# EAGLE design SGP30_breakout (EAGLE 8.3.2)
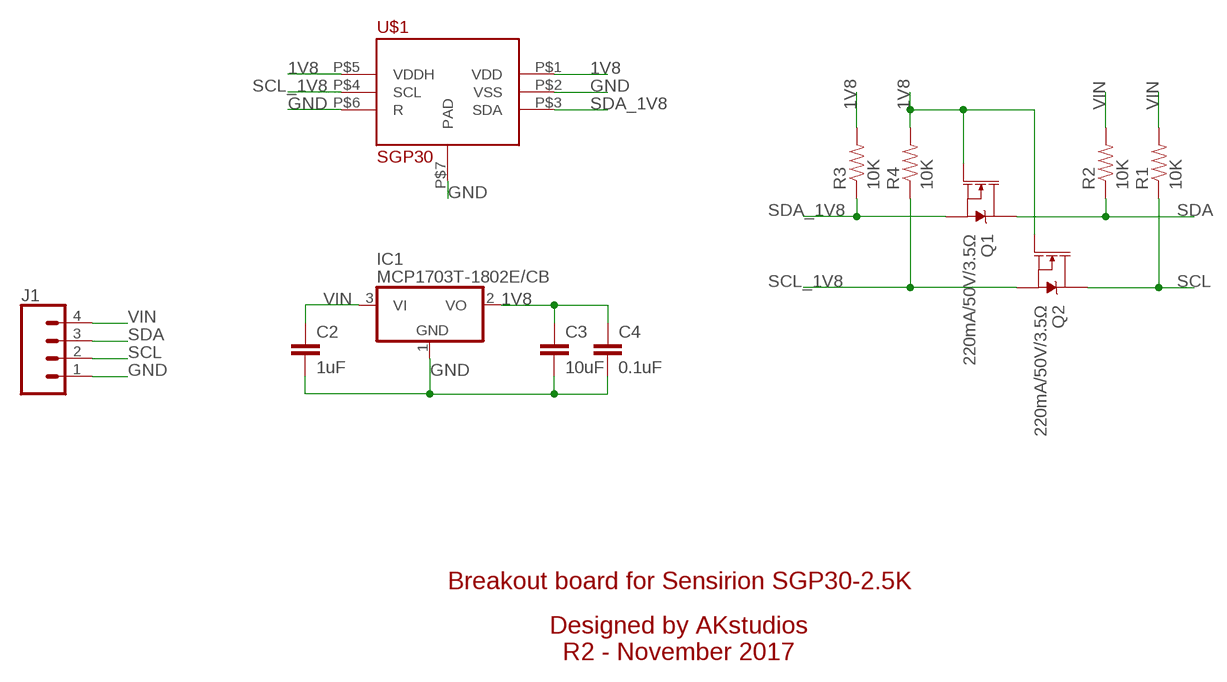
[diagram p0: schematic, sheet 1]

## Parts
C2  1uF  CAP0805  [0805]
C3  10uF  CAP0805  [0805]
C4  0.1uF  CAP0805  [0805]
IC1  MCP1703T-1802E/CB  MCP1703CB  [SOT23]
J1  CONN_04  [1X04]
Q1  220mA/50V/3.5Ω  MOSFET-NCH-BSS138  [SOT23-3]
Q2  220mA/50V/3.5Ω  MOSFET-NCH-BSS138  [SOT23-3]
R1  10K  RESISTOR0805-RES  [0805]
R2  10K  RESISTOR0805-RES  [0805]
R3  10K  RESISTOR0805-RES  [0805]
R4  10K  RESISTOR0805-RES  [0805]
U$1  SGP30  [DFN]

## Nets
1V8: C3.1 C4.1 IC1.2(VO) Q1.1(G) Q2.1(G) R3.2 R4.2 U$1.P$1(VDD) U$1.P$5(VDDH)
GND: C2.2 C3.2 C4.2 IC1.1(GND) J1.1 U$1.P$2(VSS) U$1.P$6(R) U$1.P$7(PAD)
SCL: J1.2 Q2.3(D) R1.1
SCL_1V8: Q2.2(S) R4.1 U$1.P$4(SCL)
SDA: J1.3 Q1.3(D) R2.1
SDA_1V8: Q1.2(S) R3.1 U$1.P$3(SDA)
VIN: C2.1 IC1.3(VI) J1.4 R1.2 R2.2

## Notes on the sheet
- Breakout board for Sensirion SGP30-2.5K
- Designed by AKstudios
  R2 - November 2017

## Library data of the parts
C2-C4 = SparkFun-Passives:CAP: Capacitor Standard 0603 ceramic capacitor, and 0.1" leaded capacitor.
IC1 = linear:MCP1703: 250 mA, 16V, Low Quiescent Current LDO Regulator Source: http://ww1.microchip.com/downloads/en/DeviceDoc/22049b.pdf
J1 = SparkFun-Connectors:CONN_04: Multi connection point. Often used as Generic Header-pin footprint for 0.1 inch spaced/style header connections On any of the 0.1 inch spaced packages, you can populate with these: Break Away Headers - Straight <https://www.sparkfun.com/products/116> (PRT-00116) Break Away Male Headers - Right Angle <https://www.sparkfun.com/products/553> (PRT-00553) Female Headers <https://www.sparkfun.com/products/115> (PRT-00115) Break Away Headers - Machine Pin <https://www.sparkfun.com/products/117> (PRT-00117) Break Away Female Headers - Swiss Machine Pin <https://www.sparkfun.com/products/743> (PRT-00743) For SCREWTERMINALS and SPRING TERMINALS visit here: Screw Terimnals on SparkFun.com <https://www.sparkfun.com/search/results?term=Screw+Terminals> (5mm/3.5mm/2.54mm spacing) This device is also useful as a general connection point to wire up your design to another part of your project. Our various solder wires solder well into these plated through hole pads. Hook-Up Wire - Assortment (Stranded, 22 AWG) <https://www.sparkfun.com/products/11375> (PRT-11375) Hook-Up Wire - Assortment (Solid Core, 22 AWG) <https://www.sparkfun.com/products/11367> (PRT-11367) View the entire wire category on our website here <https://www.sparkfun.com/categories/141> Special notes: Molex polarized connector foot print use with SKU : PRT-08231 with associated crimp pins and housings. 1MM SMD Version SKU: PRT-10208; PROD_ID: CONN-09696
Q1 Q2 = SparkFun-DiscreteSemi:MOSFET-NCH: N-channel MOSFETs Voltage controlled devices that allow control of high current outputs. SparkFun Products: SparkFun OpenScale <https://www.sparkfun.com/products/13261> SparkFun Digital Sandbox <https://www.sparkfun.com/products/12651> SparkFun Monster Moto Shield <https://www.sparkfun.com/products/10182> SparkFun MOSFET Power Controller <https://www.sparkfun.com/products/11214>; PROD_ID: TRANS-00830
R1-R4 = SparkFun-Passives:RESISTOR: Resistor Basic schematic elements and footprints for 0603, 1206, and PTH resistors.
U$1 = SGP30:SGP30: Sensirion SGP30 Multi-pixel gas sensor by Sensirion MPN: SGP30-2.5K Datasheet <https://www.sensirion.com/fileadmin/user_upload/customers/sensirion/Dokumente/9_Gas_Sensors/Sensirion_Gas_Sensors_SGP30_Datasheet_EN.pdf>

## Board
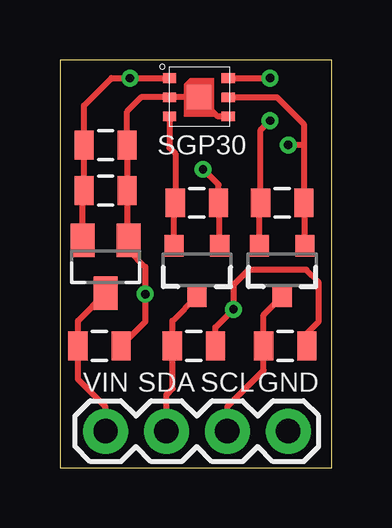
[diagram p1: board, top side]
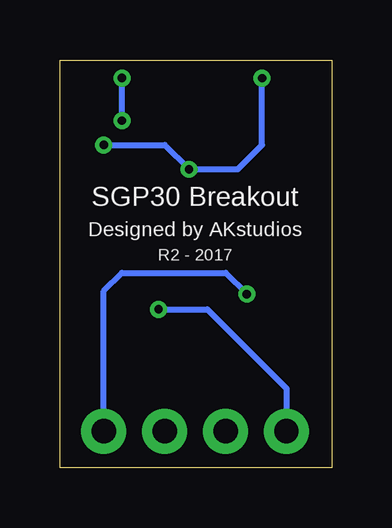
[diagram p2: board, bottom side, seen from below]

Size 11.35 x 17.01 mm. Coordinates in mm from the lower left corner, seen from the top.
Outline: 0,0 11.35,0 11.35,17.01 0,17.01 0,0
Copper layers (1*16): Top 0.0356mm / dielectric 1.5011mm / Bottom 0.0356mm
Design rules "oshpark-2layer": minimum track width 6mil, minimum drill 13mil, track to track 6mil, track to pad 6mil, pad to pad 6mil, via to via 6mil, smd to smd 6mil, copper to edge 15mil, drill to drill 6mil, minimum pad ring 7mil, minimum via ring 7mil, stop-mask expansion 2.5mil, vias tented up to drill 0mil, thermal gap 10mil

### Footprints (pad centres in the part's own frame; a part is rotated, then mirrored left to right if it is on the bottom)
0805 = smd 0.8 x 1.2: 1 -0.9,0; 2 0.9,0
SOT23 = smd 1 x 1.4: 1 -0.95,-1.1; 2 0.95,-1.1; 3 0,1.1
1X04 = drill 1.016 pad 1.88: 1 0,0; 2 2.54,0; 3 5.08,0; 4 7.62,0
SOT23-3 = smd 0.8 x 0.9: 1 -0.95,-1; 2 0.95,-1; 3 0,1.1
DFN = smd 0.55 x 0.4: P$1 0,2.025; P$2 0,1.225; P$3 0,0.425; P$4 2.45,2.025; P$5 2.45,1.225; P$6 2.45,0.425 | smd 1 x 1: P$7 1.225,1.225

### Placement (x,y rotation side)
C2  1.65,5.08 0 top
C3  1.91,11.56 0 top
C4  1.91,13.46 0 top
IC1  1.91,8.38 180 top
J1  9.52,1.52 180 top
Q1  5.71,8.25 180 top
Q2  9.27,8.25 180 top
R1  9.4,5.08 0 top
R2  5.59,5.08 0 top
R3  5.71,11.05 0 top
R4  9.27,11.05 0 top
U$1  4.57,14.22 0 top

### Tracks (layer width: path | path; a pad name or v marks a point on that pad's centre or on a via)
1V8  (via drill 0.35)
  Top 0.254: IC1.2 0.96,11.51 C3.1 C4.1 1,15.1 2.15,16.25 v2.92,16.25 U$1.P$1 | Q1.1 6.67,11 R3.2 6.62,11.8 v5.97,12.45 | Q2.1 10.22,11 R4.2 10.17,13.46 | 10.17,13.46 10.17,14.34 9.06,15.45 U$1.P$5 | 10.17,13.46 v9.52,13.46
  Bottom 0.254: v2.92,16.25 2.92,13.46 3.94,12.45 v5.97,12.45 6.99,13.46 v9.52,13.46
GND  (via drill 0.35)
  Top 0.254: U$1.P$6 6.6,14.65 U$1.P$7 U$1.P$2 3.38,15.45 2.8,14.87 C4.2 C3.2 2.8,9.53 IC1.1 2.86,9.08 3.56,8.38 v3.56,7.24 3.56,6.08 C2.2
  Bottom 0.254: J1.1 9.52,7.37 8.76,8.13 4.45,8.13 v3.56,7.24
SCL
  Top 0.254: 8.5,4.06 8.5,4.05 | 8.5,4.06 R1.1 8.5,6.38 Q2.3 | J1.2 6.99,2.55 8.5,4.06
SCL_1V8  (via drill 0.35)
  Top 0.254: Q2.2 8.32,11 R4.1 8.37,14.09 v8.76,14.48 | U$1.P$4 8.5,16.25 v8.76,16.26
  Bottom 0.254: v8.76,14.48 v8.76,16.26
SDA
  Top 0.254: Q1.3 4.69,6.13 R2.1 4.7,5.07 4.7,3.3 4.45,3.05 J1.3
SDA_1V8
  Top 0.254: Q1.2 4.77,11 R3.1 4.82,13.09 4.57,13.34 U$1.P$3
VIN  (via drill 0.35)
  Top 0.254: IC1.3 0.75,6.13 C2.1 0.75,3.69 1.91,2.54 J1.4 | R2.2 6.49,5.85 v7.24,6.6 7.24,7.62 7.87,8.25 10.29,8.25 10.79,7.75 10.79,6.1 10.3,5.6 R1.2
  Bottom 0.254: J1.4 1.91,3.3 5.21,6.6 v7.24,6.6

### Text on the board
tPlace: VIN | SDA | SCL | GND
bPlace: SGP30 Breakout | Designed by AKstudios | R2 - 2017